# EAGLE board iv17-display-shield (EAGLE 7.3.0), part 1 of 2
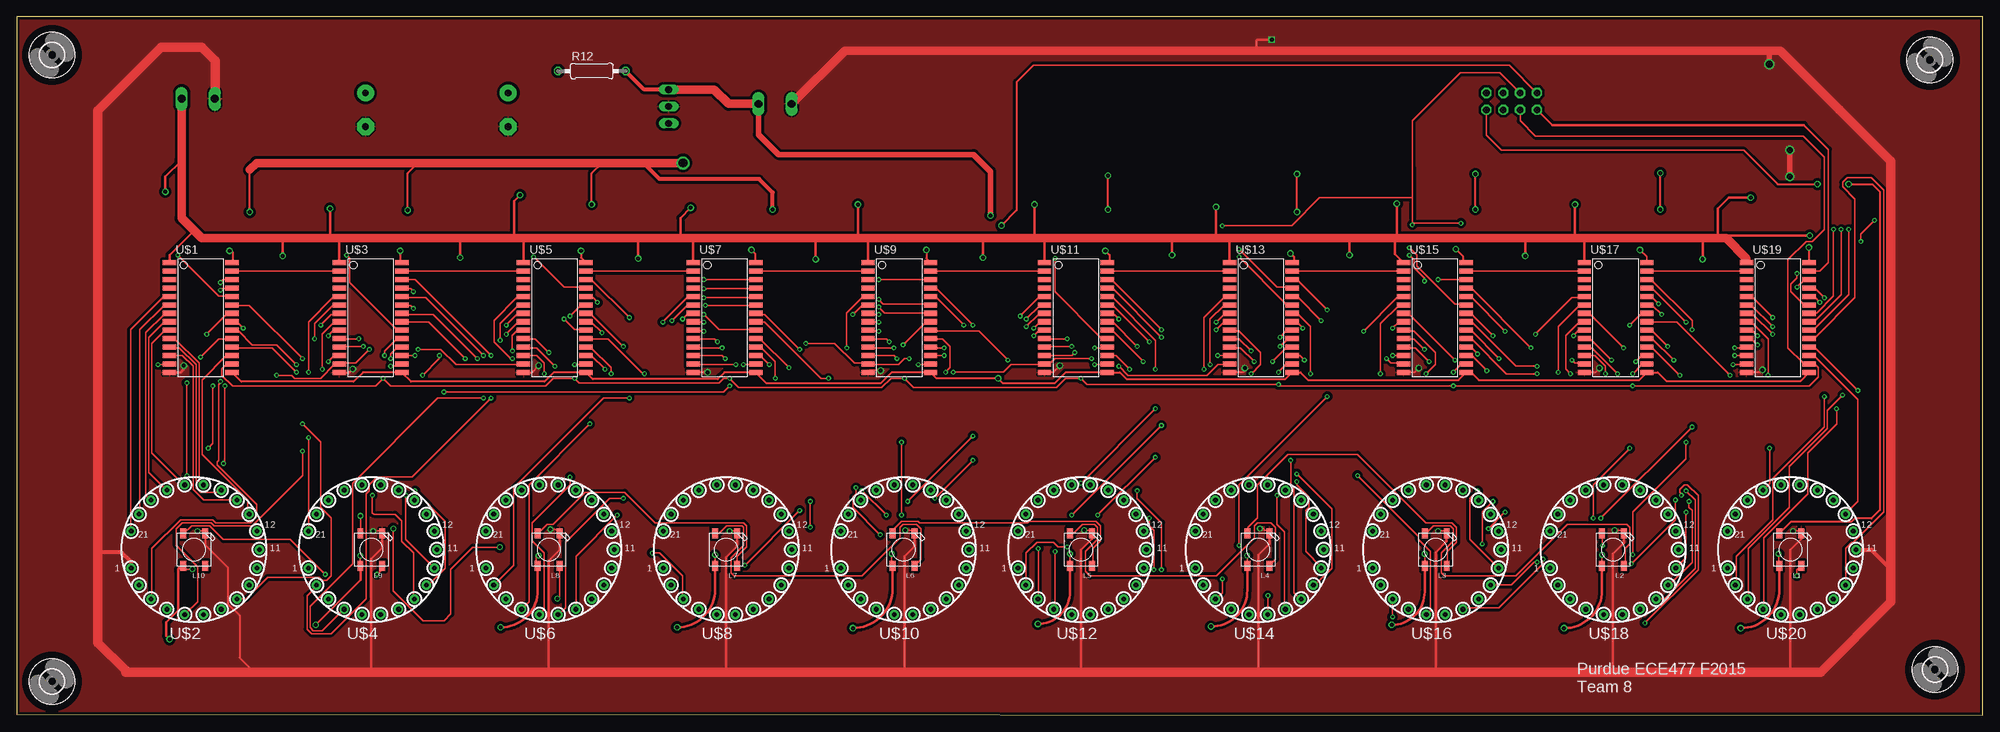
[diagram p2: board, top side]
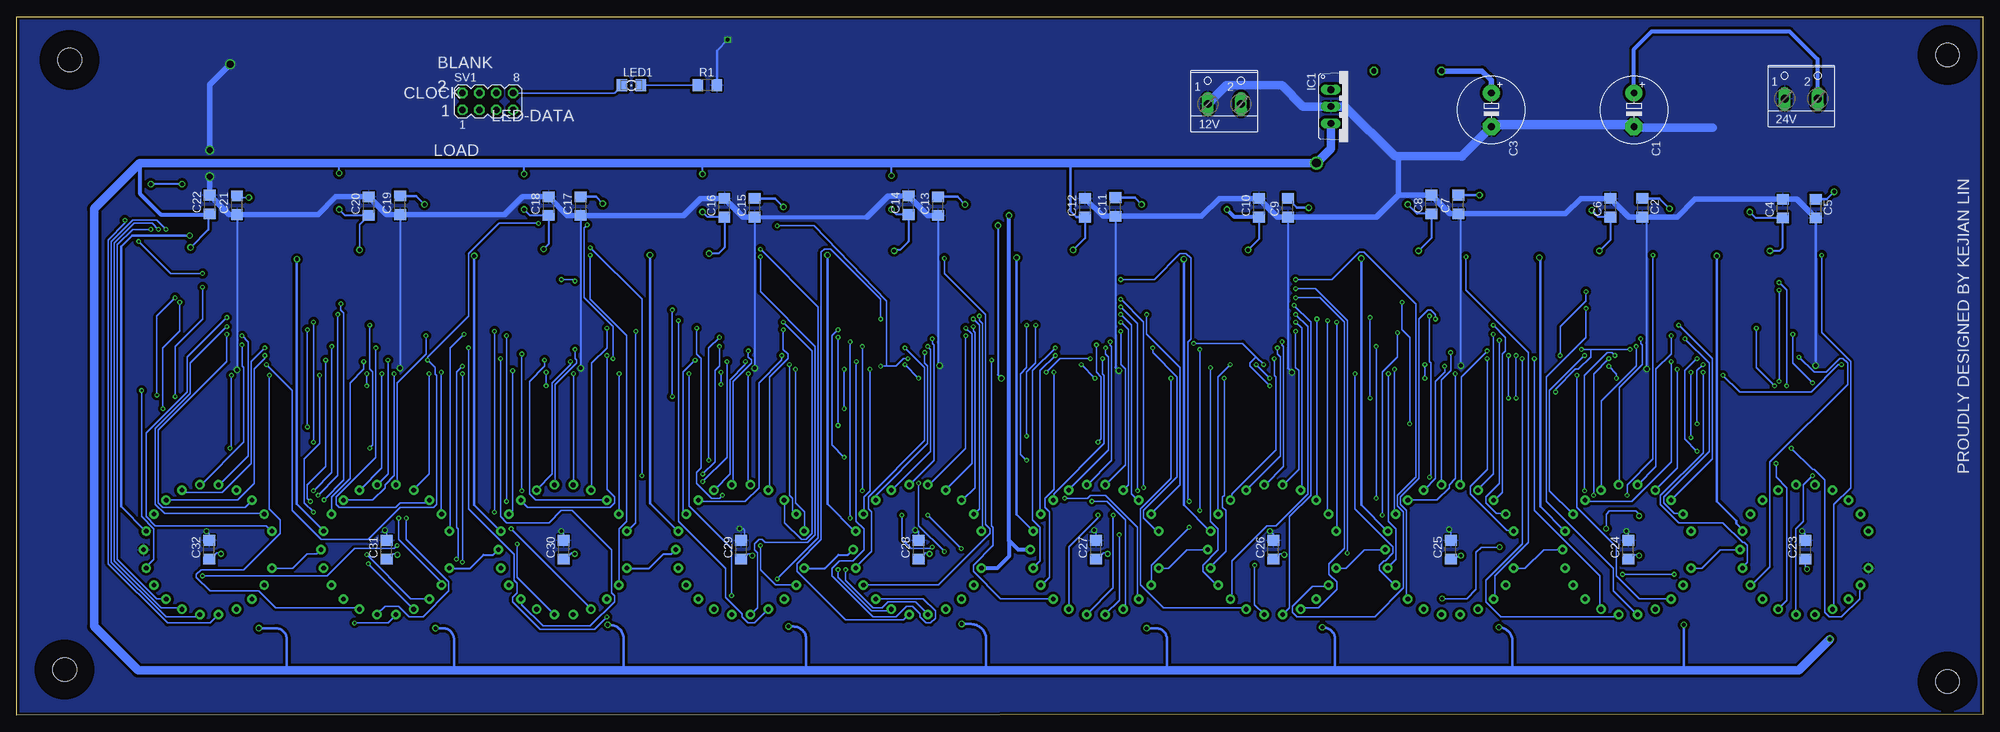
[diagram p3: board, bottom side, seen from below]

Size 295.64 x 105.08 mm. Coordinates in mm from the lower left corner, seen from the top.
Outline: 0,0.13 295.64,0 295.64,105.08 0,105.08 0,0.13
Copper layers (1*16): Top 0.0356mm / dielectric 1.5011mm / Bottom 0.0356mm
Design rules "477rec *": minimum track width 8mil, minimum drill 13mil, track to track 10mil, track to pad 10mil, pad to pad 10mil, via to via 10mil, smd to smd 6mil, copper to edge 15mil, drill to drill 8mil, minimum pad ring 7mil, minimum via ring 7mil, stop-mask expansion 3mil, vias tented up to drill 0mil, thermal gap 10mil

## Footprints (pad centres in the part's own frame; a part is rotated, then mirrored left to right if it is on the bottom)
W237-102 = drill 1.194 long: 1 -2.5,-1.27; 2 2.5,-1.27
E5-10,5 = drill 1.016 pad 2.54: + -2.54,0 | drill 1.016 pad 2.54 octagon: - 2.54,0
C1206 = smd 1.6 x 1.8: 1 -1.4,0; 2 1.4,0
TO220V = drill 1.016 long: 1 -2.54,-2.54; 2 0,-2.54; 3 2.54,-2.54
WS2812B = smd 1.5 x 0.9: 1-VDD 2.45,-1.65; 2-DOUT 2.45,1.65; 3-GND -2.45,1.65; 4-DIN -2.45,-1.65
1206 = smd 1.6 x 1.803: A -1.422,0; C 1.422,0
R1206 = smd 1.6 x 1.803: 1 -1.422,0; 2 1.422,0
0207/10 = drill 0.813 octagon: 1 -5.08,0; 2 5.08,0
MA04-2 = drill 1.016 octagon: 1 -3.81,-1.27; 2 -3.81,1.27; 3 -1.27,-1.27; 4 -1.27,1.27; 5 1.27,-1.27; 6 1.27,1.27; 7 3.81,-1.27; 8 3.81,1.27
SOIC-28W = smd 0.762 x 2: 1 -8.89,-4.7; 2 -7.62,-4.7; 3 -6.35,-4.7; 4 -5.08,-4.7; 5 -3.81,-4.7; 6 -2.54,-4.7; 7 -1.27,-4.7; 8 0,-4.7; 9 1.27,-4.7; 10 2.54,-4.7; 11 3.81,-4.7; 12 5.08,-4.7; 13 6.35,-4.7; 14 7.62,-4.7; 15 7.62,4.7; 16 6.35,4.7; 17 5.08,4.7; 18 3.81,4.7; 19 2.54,4.7; 20 1.27,4.7; 21 0,4.7; 22 -1.27,4.7; 23 -2.54,4.7; 24 -3.81,4.7; 25 -5.08,4.7; 26 -6.35,4.7; 27 -7.62,4.7; 28 -8.89,4.7
NIXIE-22 = drill 0.7 pad 1.422: 1 -9.451,-2.775; 2 -8.287,-5.325; 3 -6.45,-7.444; 4 -4.092,-8.96; 5 -1.402,-9.75; 6 1.402,-9.75; 7 4.092,-8.96; 8 6.45,-7.444; 9 8.287,-5.325; 10 9.451,-2.775; 11 9.85,0; 12 9.451,2.775; 13 8.287,5.325; 14 6.45,7.444; 15 4.092,8.96; 16 1.402,9.75; 17 -1.402,9.75; 18 -4.092,8.96; 19 -6.45,7.444; 20 -8.287,5.325; 21 -9.451,2.775
3,6 = hole 3.6: 0,0

## Placement (x,y rotation side)
12V  [W237-102]  114.05,93.22 0 bottom
24V  [W237-102]  27.3,93.98 0 bottom
C1  470uf  [E5-10,5]  52.45,91.06 270 bottom
C2  100nf  [C1206]  51.18,76.33 270 bottom
C3  470uf  [E5-10,5]  73.91,91.06 270 bottom
C4  100nf  [C1206]  30.1,76.2 90 bottom
C5  100nf  [C1206]  25.15,76.2 270 bottom
C6  100nf  [C1206]  56.01,76.33 90 bottom
C7  100nf  [C1206]  78.87,76.84 90 bottom
C8  100nf  [C1206]  82.93,76.84 90 bottom
C9  100nf  [C1206]  104.52,76.33 90 bottom
C10  100nf  [C1206]  108.84,76.33 90 bottom
C11  100nf  [C1206]  130.43,76.45 90 bottom
C12  100nf  [C1206]  135,76.33 90 bottom
C13  100nf  [C1206]  157.1,76.58 90 bottom
C14  100nf  [C1206]  161.54,76.71 90 bottom
C15  100nf  [C1206]  184.66,76.33 90 bottom
C16  100nf  [C1206]  189.23,76.33 90 bottom
C17  100nf  [C1206]  210.82,76.58 90 bottom
C18  100nf  [C1206]  215.65,76.58 90 bottom
C19  100nf  [C1206]  238,76.71 90 bottom
C20  100nf  [C1206]  242.7,76.58 90 bottom
C21  100nf  [C1206]  262.51,76.71 90 bottom
C22  100nf  [C1206]  266.57,76.84 90 bottom
C23  100nf  [C1206]  26.67,24.89 90 bottom
C24  100nf  [C1206]  53.34,24.89 90 bottom
C25  100nf  [C1206]  80.01,24.89 90 bottom
C26  100nf  [C1206]  106.68,24.89 90 bottom
C27  100nf  [C1206]  133.35,24.89 90 bottom
C28  100nf  [C1206]  160.02,24.89 90 bottom
C29  100nf  [C1206]  186.69,24.89 90 bottom
C30  100nf  [C1206]  213.36,24.89 90 bottom
C31  100nf  [C1206]  240.03,24.89 90 bottom
C32  100nf  [C1206]  266.7,24.89 90 bottom
IC1  MURATA 5V  [TO220V]  95.5,91.57 270 bottom
L1  WS2812B  [WS2812B]  266.7,24.89 270 top
L2  WS2812B  [WS2812B]  240.03,24.89 270 top
L3  WS2812B  [WS2812B]  213.36,24.89 270 top
L4  WS2812B  [WS2812B]  186.69,24.89 270 top
L5  WS2812B  [WS2812B]  160.02,24.89 270 top
L6  WS2812B  [WS2812B]  133.35,24.89 270 top
L7  WS2812B  [WS2812B]  106.68,24.89 270 top
L8  WS2812B  [WS2812B]  80.01,24.89 270 top
L9  WS2812B  [WS2812B]  53.34,24.89 270 top
L10  WS2812B  [WS2812B]  26.67,24.89 270 top
LED1  [1206]  203.2,94.74 0 bottom
R1  [R1206]  191.77,94.74 0 bottom
R12  [0207/10]  86.49,96.9 0 top
SV1  [MA04-2]  224.79,92.33 0 bottom
U$1  MAX6921  [SOIC-28W]  27.69,59.18 270 top
U$2  IV17  [NIXIE-22]  26.67,24.89 0 top
U$3  MAX6921  [SOIC-28W]  53.21,59.18 270 top
U$4  IV17  [NIXIE-22]  53.34,24.89 0 top
U$5  MAX6921  [SOIC-28W]  80.9,59.18 270 top
U$6  IV17  [NIXIE-22]  80.01,24.89 0 top
U$7  MAX6921  [SOIC-28W]  106.43,59.18 270 top
U$8  IV17  [NIXIE-22]  106.68,24.89 0 top
U$9  MAX6921  [SOIC-28W]  132.72,59.18 270 top
U$10  IV17  [NIXIE-22]  133.35,24.89 0 top
U$11  MAX6921  [SOIC-28W]  159.26,59.18 270 top
U$12  IV17  [NIXIE-22]  160.02,24.89 0 top
U$13  MAX6921  [SOIC-28W]  187.07,59.18 270 top
U$14  IV17  [NIXIE-22]  186.69,24.89 0 top
U$15  MAX6921  [SOIC-28W]  213.23,59.18 270 top
U$16  IV17  [NIXIE-22]  213.36,24.89 0 top
U$17  MAX6921  [SOIC-28W]  240.41,59.18 270 top
U$18  IV17  [NIXIE-22]  240.03,24.89 0 top
U$19  MAX6921  [SOIC-28W]  264.8,59.18 270 top
U$20  IV17  [NIXIE-22]  266.7,24.89 0 top
U$21  [3,6]  5.33,99.31 0 top
U$22  [3,6]  5.33,5.08 0 top
U$23  [3,6]  287.65,98.55 0 top
U$24  [3,6]  288.42,6.86 0 top

## Tracks (layer width: path | path; a pad name or v marks a point on that pad's centre or on a via)
5VDC  (via drill 0.5, 0.6, 1.3)
  Top 0.203: 217.4,68.05 217.86,68.05 U$15.28
  Top 0.254: U$17.28 245.11,68.96 v244.09,69.98 | v26.42,21.97 25.49,21.97 L10.1-VDD | v51.69,24 L9.1-VDD | v78.49,24 78.36,24 78.11,23.75 78.11,22.7 L8.1-VDD | v105.03,24.13 L7.1-VDD | v131.57,24.26 131.57,22.57 L6.1-VDD | v158.37,24.26 L5.1-VDD | v185.04,24 L4.1-VDD | v211.71,24.26 L3.1-VDD | v238.38,24.13 L2.1-VDD | v264.92,24.26 264.92,22.57 L1.1-VDD
  Top 0.305: v32,69.85 32.26,69.85 32.51,69.6 32.51,68.2 U$1.28 | v57.66,69.85 57.66,68.33 U$3.28 | v84.84,69.85 84.84,68.84 U$5.28 | v110.49,69.98 111,69.47 111,68.2 U$7.28 | v136.78,69.98 136.78,68.71 U$9.28 | v163.7,69.85 164.34,69.22 164.34,68.45 U$11.28 | v191.52,69.47 192.02,68.96 192.02,68.33 U$13.28 | v216.41,70.1 217.42,69.09 217.42,68.07 217.4,68.05 217.3,67.95 | v269.49,70.36 U$19.28 | v35.05,75.69 35.05,82.04 | v58.8,75.95 58.8,81.53 60.33,83.06 | v86.49,76.84 86.49,81.53 88.01,83.06 | v192.53,75.69 v192.53,81.41 | v219.33,76.07 v219.33,81.41 | v247.14,76.07 v247.14,81.53 | v164.08,76.07 v164.08,81.15
  Top 0.406: L9.1-VDD 51.69,20.32 v44.96,13.59 | L7.1-VDD 105.03,18.92 arc-90 v99.31,13.21 | L6.1-VDD 131.7,19.05 arc-90 v125.73,13.08 | L5.1-VDD 158.37,18.54 arc-90 v153.54,13.72 | L4.1-VDD 185.04,18.8 arc-90 v179.58,13.34 | L3.1-VDD 211.71,18.54 | 211.71,18.54 arc-90 v206.76,13.59 arc90 211.71,18.54 | L2.1-VDD 238.38,18.8 arc-90 v232.66,13.08 | L10.1-VDD arc90 24.26,21.68 24.26,15.75 22.48,13.97 22.48,11.94 v22.99,11.43 | L1.1-VDD 265.05,18.92 | 265.05,18.92 arc-90 v259.21,13.08 arc90 265.05,18.92 | L8.1-VDD 78.36,18.8 arc-90 v72.77,13.21
  Top 0.61: v113.67,76.07 113.67,78.61 111.63,80.65 96.65,80.65 94.23,83.06
  Top 1.27: v100.2,83.06 94.23,83.06 88.01,83.06 60.33,83.06 36.07,83.06 35.05,82.04
  Bottom 0.254: v244.09,69.98 244.09,73.78 C20.1 | C23.1 26.67,22.23 v26.42,21.97 | C24.1 52.96,23.49 52.32,24.13 51.82,24.13 v51.69,24 | C25.1 79.38,23.49 78.87,24 v78.49,24 | C26.1 106.55,23.49 106.43,23.37 106.43,23.49 105.66,24.26 105.16,24.26 v105.03,24.13 | C27.1 133.1,23.49 132.21,24.38 131.7,24.38 v131.57,24.26 | C28.1 159.89,23.37 159.89,23.49 159,24.38 158.5,24.38 v158.37,24.26 | C29.1 186.44,23.49 185.67,24.26 185.29,24.26 v185.04,24 | C30.1 213.11,23.49 212.22,24.38 211.84,24.38 v211.71,24.26 | C31.1 239.78,23.49 239.01,24.26 238.51,24.26 v238.38,24.13 | C32.1 266.45,23.49 265.56,24.38 265.05,24.38 v264.92,24.26
  Bottom 0.305: v32,69.85 30.61,69.85 30.1,70.36 C4.1 34.16,74.8 v35.05,75.69 | v57.66,69.85 56.01,71.5 C6.1 57.78,74.93 v58.8,75.95 | v84.84,69.85 82.93,71.75 C8.1 85.09,75.44 v86.49,76.84 | C10.1 108.84,71.63 v110.49,69.98 | C12.1 135,71.75 v136.78,69.98 | v163.7,69.85 163.58,69.98 162.81,69.98 161.54,71.25 C14.1 163.32,75.31 v164.08,76.07 | v191.52,69.47 190.12,69.47 189.23,70.36 C16.1 191.77,74.93 v192.53,75.69 | v216.41,70.1 215.65,70.87 C18.1 218.44,75.18 v219.33,76.07 | C22.1 266.57,75.18 266.83,74.93 266.83,73.03 v269.49,70.36 | 165.35,82.8 165.61,83.06 | v192.53,81.41 192.53,82.93 192.66,83.06 | v219.33,81.41 219.33,82.93 219.46,83.06 | C20.1 246.25,75.18 v247.14,76.07 | v247.14,81.53 247.14,83.06 | v164.08,81.15 164.08,82.55 163.58,83.06
  Bottom 0.406: v99.31,13.21 99.19,13.21 arc90 97.41,11.43 97.41,6.98 97.16,6.73 | v125.73,13.08 124.33,13.08 arc90 122.68,11.43 122.68,7.24 123.19,6.73 | v153.54,13.72 152.15,13.72 arc90 149.86,11.43 149.86,6.98 150.11,6.73 | v179.58,13.34 178.82,13.34 arc90 176.91,11.43 176.91,7.11 177.29,6.73 | 206.5,13.59 arc90 204.34,11.43 | v232.66,13.08 231.52,13.08 arc90 229.87,11.43 229.87,7.11 230.25,6.73 | 256.67,13.08 arc90 255.02,11.43 | C12.1 136.27,74.93 137.16,75.82 137.16,82.8 136.91,83.06 | v44.96,13.59 44.96,6.73 | v259.21,13.08 256.67,13.08 | 256.67,13.08 arc90 255.02,11.43 | 255.02,11.43 255.02,6.86 arc90 255.14,6.73 | v206.76,13.59 206.5,13.59 | 206.5,13.59 arc90 204.34,11.43 | 204.34,11.43 204.34,6.86 arc-90 204.22,6.73 | 70.23,6.98 arc-90 69.98,6.73 | v72.77,13.21 arc90 70.74,11.18 70.74,6.73
  Bottom 0.61: 277.11,83.06 277.11,78.49 273.94,75.31 267.21,75.31 266.83,74.93 | C10.1 112.52,74.93 v113.67,76.07
  Bottom 1.27: IC1.3 98.04,85.22 v100.2,83.06 136.91,83.06 163.58,83.06 165.61,83.06 192.66,83.06 219.46,83.06 247.14,83.06 277.11,83.06 283.97,76.2 283.97,13.34 277.37,6.73 255.14,6.73 230.25,6.73 204.22,6.73 177.29,6.73 150.11,6.73 123.19,6.73 97.16,6.73 70.74,6.73 69.98,6.73 44.96,6.73 27.69,6.73 v22.99,11.43
12VDC  (via drill 0.6)
  Top 0.61: IC1.1 94.36,94.11 R12.2
  Top 0.813: 12V.2 111.55,87.34 114.55,84.33 143.89,84.33 146.43,81.79 v146.43,75.18
  Top 1.27: 12V.2 107.06,91.95 104.9,94.11 IC1.1
  Bottom 0.61: U$10.11 145.03,24.89 146.43,26.29 | 146.43,26.29 v146.43,75.18 | 146.43,26.29 146.43,23.88 148.21,22.1 150.55,22.1 U$12.1
24VDC  (via drill 0.6)
  Top 0.406: 260.1,68.71 U$19.1 | v47.12,76.2 47.12,71.75 | U$3.1 48.51,70.11 48.51,71.75 | U$5.1 76.2,70.36 76.2,71.75 | 74.8,71.75 74.8,77.34 v75.69,78.23 | U$7.1 101.73,69.85 101.73,71.75 | v101.35,76.33 99.82,74.8 99.82,71.75 | v126.49,76.84 126.49,72.01 126.24,71.75 | v153.03,76.84 153.03,71.88 153.16,71.75 | v180.34,76.45 180.34,71.88 180.21,71.75 | v207.52,76.96 207.52,72.01 207.26,71.75 207.26,69.34 U$15.1 | U$9.1 128.01,69.98 128.02,69.98 128.02,71.75 | U$11.1 154.56,70.11 154.56,71.75 | U$13.1 182.37,69.98 182.37,71.75 | U$17.1 235.71,70.49 235.71,71.75 | v260.73,77.85 257.43,77.85 255.78,76.2 255.78,71.88 | 255.78,71.88 255.78,71.75 | v234.31,76.84 234.31,71.88 234.44,71.75 | U$1.1 22.99,69.21 26.67,72.9 | v22.35,78.74 22.35,80.99 24.8,83.44 | v120.14,68.58 120.14,71.75 | 200.41,70.74 v200.41,69.22 200.41,71.75 | v269.62,72.14 256.03,72.14 255.78,71.88 | v40.01,69.09 40.01,71.75 | v66.67,68.83 66.67,71.75 | v253.49,68.58 253.49,71.75 | v226.82,69.09 226.82,71.75 | v173.74,69.22 173.74,71.75 | v145.29,68.83 145.29,71.75 | v93.47,68.71 93.47,71.75
  Top 1.27: 24V.2 24.8,83.44 24.8,74.76 26.67,72.9 27.81,71.75 40.01,71.75 47.12,71.75 48.51,71.75 66.67,71.75 74.8,71.75 76.2,71.75 93.47,71.75 99.82,71.75 101.73,71.75 120.14,71.75 126.24,71.75 128.02,71.75 145.29,71.75 153.16,71.75 154.56,71.75 173.74,71.75 180.21,71.75 182.37,71.75 200.41,71.75 207.26,71.75 226.82,71.75 234.44,71.75 235.71,71.75 253.49,71.75 255.78,71.75 257.05,71.75 260.1,68.71
  Bottom 0.254: v260.73,77.85 262.25,77.85 C21.2
  Bottom 0.406: C2.1 48.64,77.73 v47.12,76.2 | v75.69,78.23 C7.2 | v101.35,76.33 103.12,76.33 C9.2 | C11.2 127.51,77.85 v126.49,76.84 | C13.2 154.18,77.98 v153.03,76.84 | C15.2 181.61,77.73 v180.34,76.45 | C17.2 208.54,77.98 v207.52,76.96 | C19.2 235.59,78.11 v234.31,76.84 | 25.15,77.85 C5.1 23.49,77.6 v22.35,78.74 | U$2.12 36.12,27.87 37.08,28.83 37.08,29.21 40.01,32.13 v40.01,69.09 | U$4.12 62.85,27.67 66.55,31.37 66.55,68.71 v66.67,68.83 | U$6.12 89.52,27.67 93.47,31.62 v93.47,68.71 | U$8.12 116.19,27.67 120.14,31.62 v120.14,68.58 | U$10.12 142.8,27.74 145.29,30.23 v145.29,68.83 | U$12.12 169.65,27.67 173.74,31.75 v173.74,69.22 | U$14.12 196.2,27.67 200.41,31.88 v200.41,69.22 | U$16.12 222.87,27.67 226.82,31.62 v226.82,69.09 | U$18.12 249.48,27.74 253.49,31.75 v253.49,68.58 | U$20.12 276.21,27.67 279.91,31.37 279.91,70.48 278.26,72.14 v269.62,72.14
  Bottom 0.61: C1.+ 52.45,100.2 49.78,102.87 29.08,102.87 24.89,98.68 24.89,92.8 24V.2
+12V
  Bottom 0.813: C3.+ 73.91,95.5 75.31,96.9 R12.1
AGND  (via drill 0.5, 0.6, 0.9, 1)
  Top 0.254: v267.08,27.69 268.01,27.69 L1.3-GND | v27.18,27.69 27.98,27.69 L10.3-GND | v53.59,27.69 54.65,27.69 L9.3-GND | v80.26,27.94 81.06,27.94 L8.3-GND | v107.19,27.69 107.99,27.69 L7.3-GND | v133.6,27.81 134.53,27.81 L6.3-GND | v160.53,27.81 161.2,27.81 L5.3-GND | v213.74,27.69 214.67,27.69 L3.3-GND | v240.28,27.81 241.21,27.81 L2.3-GND | v186.94,28.07 187.45,28.07 187.71,27.81 188.47,27.81 188.34,27.69 L4.3-GND
  Top 0.305: U$3.14 50.04,51.56 v50.55,52.07 | U$5.14 77.47,51.56 v78.49,52.58 | v103.89,51.56 U$7.14 | v129.92,51.82 128.27,51.82 U$9.14 | v156.84,52.58 155.83,51.56 U$11.14 | v184.66,52.2 184.66,51.82 184.4,51.56 U$13.14 | v210.82,52.2 210.19,51.56 U$15.14 | v238,52.2 237.36,51.56 U$17.14 | v262.51,51.94 262.13,51.56 U$19.14 | L10.3-GND 28.32,25.66 31.75,22.23 31.75,16.76 33.53,14.99 33.53,8.64 35.69,6.48
  Top 0.406: L9.3-GND 54.99,25.15 53.34,23.49 53.34,6.48 | L8.3-GND 81.66,24.89 80.01,23.24 80.01,6.6 79.88,6.48 | L7.3-GND 108.33,25.4 106.68,23.75 106.68,6.73 106.43,6.48 | L6.3-GND 135,25.4 133.48,23.88 133.48,6.73 133.73,6.48 | L5.3-GND 161.67,26.54 160.02,24.89 160.02,6.6 159.89,6.48 | L4.3-GND 188.34,25.78 186.69,24.13 186.69,6.6 186.56,6.48 | L3.3-GND 215.01,26.16 213.36,24.51 213.36,6.6 213.49,6.48 | L2.3-GND 241.68,25.91 240.03,24.26 240.03,6.86 239.65,6.48 | L1.3-GND 268.35,26.54 266.7,24.89 266.7,6.6 266.83,6.48 | v25.15,52.58 25.15,52.07 24.64,51.56 U$1.14 | U$2.1 17.22,22.66 | v188.72,101.6 186.56,101.6 186.44,101.47 186.44,100.08 186.56,99.95
  Top 0.61: U$20.11 278.89,24.89 281.81,21.97 | 17.22,22.66 17.22,23.04 15.75,24.51 12.19,24.51
  Top 0.813: v266.57,81.03 v266.57,84.96 | v263.52,97.92 263.52,99.95
  Top 1.27: 274.07,91.06 265.18,99.95 263.52,99.95 186.56,99.95 124.55,99.95 12V.1
  Top 1.422: 274.07,91.06 281.81,83.31 281.81,21.97 281.81,17.02 271.27,6.48 266.83,6.48 239.65,6.48 213.49,6.48 186.56,6.48 159.89,6.48 133.73,6.48 106.43,6.48 79.88,6.48 53.34,6.48 35.69,6.48 16.38,6.48 16.38,6.73 12.19,10.92 12.19,24.51 12.19,90.93 21.72,100.46 27.81,100.46 29.84,98.43 29.84,92.71 29.97,92.58
  Bottom 0.254: C32.2 266.7,27.3 v267.08,27.69 | C23.2 26.67,27.18 v27.18,27.69 | C24.2 53.34,27.43 v53.59,27.69 | C25.2 80.01,27.69 v80.26,27.94 | C26.2 106.68,27.18 v107.19,27.69 | C27.2 133.35,27.56 v133.6,27.81 | C28.2 160.02,27.69 160.15,27.81 v160.53,27.81 | C30.2 213.36,27.3 v213.74,27.69 | C31.2 240.03,27.56 v240.28,27.81 | C29.2 186.18,26.8 186.18,27.81 186.44,28.07 v186.94,28.07
  Bottom 0.305: v50.55,52.07 50.55,74.29 C2.2 | v78.49,52.58 78.49,75.05 C7.1 | C9.1 104.52,52.2 v103.89,51.56 | C11.1 130.43,52.32 v129.92,51.82 | C13.1 157.1,52.83 v156.84,52.58 | C15.1 v184.66,52.2 | C17.1 v210.82,52.2 | C19.1 v238,52.2 | C21.1 v262.51,51.94
  Bottom 0.406: C13.1 158.62,75.18 C14.2 | C20.2 | C18.2 | C16.2 | C2.2 | C6.2 | C8.2 | C10.2 | 87.88,83.82 88.14,84.07 | C5.2 v25.15,52.58 | R1.2 190.35,99.97 v188.72,101.6
  Bottom 0.61: C15.1 167.77,74.93
  Bottom 0.813: C5.2 27.95,77.6 C4.2 43.3,77.6 45.97,74.93 C2.2 | C2.2 53.21,74.93 C6.2 | C8.2 80.13,75.44 C7.1 62.74,75.44 60.45,77.72 C6.2 | C10.2 106.04,74.93 C9.1 91.19,74.93 87.88,78.23 | C12.2 132.33,75.05 C11.1 117.48,75.05 114.81,77.72 C10.2 | C15.1 186.43,74.93 C16.2 | C18.2 212.85,75.18 C17.1 195.33,75.18 192.79,77.72 C16.2 | C20.2 240.02,75.31 C19.1 222.25,75.31 219.58,77.98 C18.2 | C20.2 247.65,77.98 250.32,75.31 C21.1 263.65,75.31 C22.2 v266.57,81.03 | 167.77,74.93 164.59,78.11 C14.2 | 87.88,78.23 C8.2 | 87.88,78.23 87.88,83.82 | C13.1 158.62,75.18 C14.2 | v266.57,84.96 266.57,94.87 v263.52,97.92
  Bottom 1.27: 40.64,88.39 52.03,88.39 C1.- | 12V.1 113.75,94.74 105.41,94.74 102.23,91.57 IC1.2 95.89,91.57 88.39,84.07 88.14,84.07 78.4,84.07
  Bottom 1.422: 78.4,84.07 78.36,84.07 C3.- | 73.66,88.81 52.75,88.81 C1.-
  pour Top (isolate 0.406): 0,8.38 0,105.16 295.66,105.16 295.66,81.15 295.66,0.13 295.66,0 0,0
  pour Bottom (isolate 0.406): 0,8.38 0,105.03 295.66,105.03 295.66,98.3 295.66,0 0,0
BLANK  (via drill 0.33)
  Top 0.203: v205.97,53.64 206.65,52.96 208.48,52.96 U$15.13 | 209.85,82.45 209.85,77.88 | 209.85,77.88 209.85,73.99 | v233.86,53.42 234.31,52.96 235.69,52.96 U$17.13 | 209.85,73.99 v217.17,73.99 | 209.85,73.99 v209.85,73.76 | v258.09,52.73 259.92,52.73 U$19.13 | v21.26,52.73 22.86,52.73 U$1.13 | v39.09,51.13 41.38,51.13 41.83,50.67 45.72,50.67 47.78,52.73 48.46,52.73 U$3.13 48.69,52.96 50.98,52.96 v53.03,55.02 | v60.35,55.02 63.78,55.02 66.06,52.73 76.12,52.73 U$5.13 | v108.13,52.73 101.73,52.73 U$7.13 | v118.64,55.93 122.99,55.93 125.96,52.96 127.79,52.96 U$9.13 128.02,52.73 132.59,52.73 133.5,53.64 v134.19,53.64 | v140.82,51.59 148.36,51.59 149.5,52.73 154.53,52.73 U$11.13 154.76,52.96 155.45,52.96 156.13,53.64 v161.62,53.64 | v165.74,52.5 167.11,51.13 178.99,51.13 180.59,52.73 182.19,52.73 U$13.13 | v64.24,48.62 106.3,48.62 v107.21,49.53 | 209.85,77.88 195.91,77.88 191.77,73.61 v181.28,73.61
  Top 0.254: 209.85,82.45 209.85,89.46 217.04,96.65 223.01,96.65 SV1.4
  Bottom 0.203: v205.97,53.64 205.97,58.45 210.31,62.79 210.31,73.3 v209.85,73.76 | v217.17,73.99 223.11,73.99 227.69,69.42 227.69,60.05 233.86,53.87 v233.86,53.42 232.72,52.27 232.72,51.36 232.49,51.13 232.49,31.7 232.94,31.24 237.97,31.24 242.77,26.44 249.86,26.44 254.2,30.78 254.2,48.84 v258.09,52.73 | v21.26,52.73 21.72,52.73 25.83,48.62 36.58,48.62 v39.09,51.13 | v53.03,55.02 58.98,55.02 | 58.98,55.02 v60.35,55.02 | 109.27,53.87 111.33,55.93 v118.64,55.93 | 109.27,53.87 v108.13,52.73 | v140.82,51.59 138.76,53.64 v134.19,53.64 | 164.82,52.5 163.45,52.5 162.31,53.64 v161.62,53.64 | 164.82,52.5 v165.74,52.5 | 58.98,55.02 58.98,53.87 60.81,52.04 61.27,52.04 64.24,49.07 v64.24,48.62 | v107.21,49.53 110.19,52.5 110.19,52.96 109.27,53.87 | v181.28,73.61 175.72,73.61 164.82,62.33 164.82,52.5
CLK  (via drill 0.6)
  Top 0.254: 150.37,95.25 152.91,97.79 224.41,97.79 SV1.2
  Top 0.305: 150.37,95.25 150.37,75.95 v148.08,73.66 | U$1.15 33.78,50.16 50.67,50.16 52.07,51.56 U$3.15 59.31,50.16 79.38,50.16 80.77,51.56 U$5.15 86.61,50.55 105.41,50.55 106.43,51.56 U$7.15 112.78,49.91 129.92,49.91 131.57,51.56 U$9.15 138.3,50.67 v147.57,50.67 148.34,49.91 156.08,49.91 157.73,51.56 U$11.15 165.86,51.56 166.88,50.55 190.75,50.55 U$13.15 193.04,51.56 194.18,50.42 216.79,50.42 U$15.15 218.69,51.56 219.84,50.42 243.97,50.42 U$17.15 246.76,51.56 248.03,50.29 268.23,50.29 U$19.15
  Bottom 0.305: v148.08,73.66 148.08,51.18 v147.57,50.67
DATA
  Top 0.254: U$19.27 271.14,66.8 272.42,68.07 272.42,85.09 268.73,88.77
  Top 0.406: 268.73,88.77 230.89,88.77 SV1.1
LED-DATA  (via drill 0.6)
  Top 0.254: 260.99,83.69 259.71,84.96 223.27,84.96 220.98,87.25 SV1.7
  Top 0.305: 260.99,83.69 264.8,79.88 v270.76,79.88 | v275.46,79.88 279.02,79.88 280.16,78.74 280.16,30.86 278.89,29.59 276.35,29.59 275.84,29.08 266.79,29.08 L1.4-DIN
  Bottom 0.305: v270.76,79.88 v275.46,79.88
LOAD  (via drill 0.33)
  Top 0.203: v56.24,52.5 57.61,52.5 57.84,52.73 U$3.16 | U$1.16 32.23,52.73 31.55,52.73 30.86,52.04 30.86,51.13 32.46,49.53 53.95,49.53 v55.09,50.67 56.24,49.53 79.55,49.53 80.7,50.67 v83.9,50.67 84.58,49.99 105.61,49.99 106.3,50.67 v107.21,50.67 108.58,49.3 130.07,49.3 131.44,50.67 v133.5,50.67 134.87,49.3 156.36,49.3 157.73,50.67 v160.02,50.67 160.93,49.76 v189.74,49.76 189.97,49.53 v216.03,49.53 v243,49.53 269.52,49.53 270.89,50.9 270.89,52.27 270.43,52.73 269.52,52.73 U$19.16 269.29,52.96 268.61,52.96 266.32,55.24 266.32,68.5 269.06,71.25 269.98,71.25 271.81,73.08 271.81,81.99 | v83.9,52.73 85.5,52.73 U$5.16 | v109.27,52.73 111.1,52.73 U$7.16 | v135.56,52.73 137.39,52.73 U$9.16 | v162.08,52.73 163.91,52.73 U$11.16 | v189.74,51.59 190.88,52.73 191.57,52.73 U$13.16 | v216.03,51.59 217.17,52.73 217.86,52.73 U$15.16 | v243,51.36 244.37,52.73 245.06,52.73 U$17.16
  Top 0.254: SV1.3 226.06,89.41 228.35,87.12 268.61,87.12 271.78,83.95 271.78,82.02 271.81,81.99
  Bottom 0.203: v55.09,50.67 55.09,51.36 v56.24,52.5 | v83.9,50.67 v83.9,52.73 | v107.21,50.67 v109.27,52.73 | v133.5,50.67 v135.56,52.73 | v160.02,50.67 v162.08,52.73 | v189.74,49.76 v189.74,51.59 | v216.03,49.53 v216.03,51.59 | v243,49.53 v243,51.36
N$1  (via drill 0.33)
  Top 0.203: U$1.26 31.09,65.53 v30.63,65.08 | v29.49,49.53 29.49,40.84 v28.8,40.16
  Bottom 0.203: v30.63,65.08 29.49,63.93 v29.49,49.53 | v28.8,40.16 25.6,36.96 25.38,36.96 23.77,35.36 23.77,15.47 23.09,14.78 21.26,14.78 18.52,17.53 18.52,19.36 U$2.2
N$2  (via drill 0.33)
  Top 0.203: v30.63,63.93 30.86,64.16 32.23,64.16 U$1.25 | v30.63,50.22 30.63,49.99 30.4,49.76 30.4,38.33 30.18,38.1 30.18,37.64 36.12,31.7 36.12,29.87 35.2,28.96 29.95,28.96 29.49,29.41 24.69,29.41 20.34,25.07 20.34,17.53 U$2.3
  Bottom 0.203: v30.63,50.22 v30.63,63.93
N$3  (via drill 0.33)
  Top 0.203: v24.23,69.19 30.4,63.02 32.23,63.02 U$1.24
  Bottom 0.203: v24.23,69.19 24.23,57.53 19.89,53.19 19.89,34.21 22.4,31.7 22.4,16.15 U$2.4
N$4  (via drill 0.33)
  Top 0.203: v42.98,53.64 34.98,61.65 32.46,61.65 U$1.23 | v42.98,39.7 42.98,36.04 35.43,28.5 29.72,28.5 29.26,28.96 24.92,28.96 24,28.04 24,25.53 27.2,22.33 27.2,17.07 25.38,15.24 U$2.5
  Bottom 0.203: v42.98,53.64 44.81,51.82 44.81,41.53 v42.98,39.7
N$5  (via drill 0.33)
  Top 0.203: v28.57,57.3 31.55,60.27 32.23,60.27 U$1.22 | v25.6,36.04 v25.6,49.99
  Bottom 0.203: v28.57,57.3 28.57,52.96 v25.6,49.99 | v25.6,36.04 26.98,34.67 26.98,29.19 28.12,28.04 28.12,15.24 U$2.6
N$6  (via drill 0.33)
  Top 0.203: v34.06,58.22 33.15,59.13 32.46,59.13 U$1.21 | v31.32,49.53 31.32,38.1 v31.09,37.87
  Bottom 0.203: v34.06,58.22 34.06,52.27 v31.32,49.53 | v31.09,37.87 31.09,35.81 29.49,34.21 29.49,17.3 30.63,16.15 U$2.7
N$7  (via drill 0.33)
  Top 0.203: v42.06,52.73 39.09,55.7 35.43,55.7 33.38,57.76 32.46,57.76 U$1.20 | v42.98,43.81 45.72,41.07 45.72,31.24 47.32,29.64 47.32,20.95 46.63,20.27 45.95,20.27 45.49,20.73 37.72,20.73 34.52,17.53 33.15,17.53 U$2.8
  Bottom 0.203: v42.06,52.73 42.98,51.82 v42.98,43.81
N$8  (via drill 0.33)
  Top 0.203: v27.66,53.87 30.4,56.62 32.23,56.62 U$1.19
  Bottom 0.203: v27.66,53.87 25.38,51.59 23.55,51.59 21.49,53.64 21.03,53.64 20.34,52.96 20.34,49.76 32,38.1 32,22.33 34.75,19.58 U$2.9
N$9  (via drill 0.33)
  Top 0.203: v42.06,51.59 38.41,55.24 32.46,55.24 U$1.18
  Bottom 0.203: v42.06,51.59 42.06,39.47 48.46,33.07 48.46,31.7 45.72,28.96 39.09,28.96 36.12,25.98 35.89,25.98 35.43,25.53 35.43,23.01 36.12,22.33 U$2.10
N$10
  Top 0.203: U$1.17 31.55,54.1 27.89,50.44 27.89,39.24 34.75,32.38 34.75,30.33 U$2.13
N$11
  Top 0.203: U$1.12 24.92,54.1 26.52,52.5 26.52,33.98 28.12,32.38 32.92,32.38 U$2.14
N$12
  Top 0.203: U$1.11 23.09,55.24 24.46,55.24 26.98,52.73 26.98,34.21 27.66,33.53 30.4,33.53 30.63,33.76 U$2.15
N$13
  Top 0.203: U$1.10 23.09,56.62 23.77,56.62 27.43,52.96 27.43,35.13 27.89,34.67 U$2.16
N$14
  Top 0.203: U$1.9 22.86,57.76 22.17,57.76 20.34,55.93 20.34,39.47 25.15,34.67 U$2.17
N$15
  Top 0.203: U$1.8 22.86,59.13 22.17,59.13 19.89,56.84 19.89,36.5 22.4,33.98 U$2.18
N$16
  Top 0.203: U$1.7 22.86,60.27 22.17,60.27 19.43,57.53 19.43,33.07 20.12,32.38 U$2.19
N$17
  Top 0.203: U$1.6 22.86,61.65 22.17,61.65 18.52,57.99 18.52,30.33 U$2.20
N$18
  Top 0.203: U$1.5 22.86,62.79 21.95,62.79 17.14,57.99 17.14,27.81 U$2.21
N$19  (via drill 0.33)
  Top 0.203: U$3.26 59.89,65.53 v71.32,54.1 | v71.32,47.7 59.44,35.81 54.18,35.81 53.03,34.67 53.03,33.76 52.58,33.3 52.58,17.53 47.32,12.27 44.35,12.27 43.66,12.95 43.66,17.98 45.03,19.36 U$4.2
  Bottom 0.203: v71.32,47.7 v71.32,54.1
N$20  (via drill 0.33)
  Top 0.203: v59.66,63.7 59.21,64.16 58.06,64.16 U$3.25 | v63.55,54.1 63.55,53.64 v61.04,51.13
  Bottom 0.203: v59.66,63.7 59.66,62.33 63.55,58.45 v63.55,54.1 | v61.04,51.13 61.04,31.24 55.09,25.3 55.09,20.95 51.66,17.53 47.09,17.53 U$4.3
N$21  (via drill 0.33)
  Top 0.203: v70.18,54.1 61.49,62.79 58.06,62.79 U$3.24 | v70.18,47.7 63.32,47.7 50.52,34.9 50.52,22.78 44.12,16.38 44.12,13.18 44.58,12.72 45.95,12.72 49.15,15.93 U$4.4
  Bottom 0.203: v70.18,47.7 v70.18,54.1
N$22  (via drill 0.33)
  Top 0.203: v59.66,61.19 59.21,61.65 58.06,61.65 U$3.23
  Bottom 0.203: v59.66,61.19 59.66,56.84 65.61,50.9 65.61,32.16 55.55,22.1 55.55,18.67 52.12,15.24 U$4.5
N$23
  Top 0.254: U$17.27 U$19.2
N$24  (via drill 0.33)
  Top 0.203: v69.27,53.64 62.64,60.27 58.06,60.27 U$3.22
  Bottom 0.203: v69.27,53.64 69.27,25.76 74.75,20.27 74.75,17.07 72.47,14.78 55.09,14.78 54.86,15.01 U$4.6
N$25  (via drill 0.33)
  Top 0.203: v67.44,53.64 61.95,59.13 58.06,59.13 U$3.21
  Bottom 0.203: v67.44,53.64 67.44,30.78 57.61,20.95 57.61,16.15 U$4.7
N$26  (via drill 0.33)
  Top 0.203: v49.61,69.19 50.06,68.73 50.06,65.08 57.15,57.99 57.84,57.99 U$3.20 | 53.49,30.56 v53.49,33.07 | 59.66,24.38 59.66,17.53 U$4.8
  Top 0.254: 53.49,30.56 53.49,30.45 53.72,30.23 56.9,30.23 57.91,29.21 57.91,26.14 59.66,24.38
  Bottom 0.203: v49.61,69.19 49.61,38.56 53.49,34.67 v53.49,33.07
N$27  (via drill 0.33)
  Top 0.203: v55.32,54.1 55.32,54.79 57.15,56.62 57.84,56.62 U$3.19 | v59.89,33.76 64.47,29.19 64.47,22.1 61.72,19.36 U$4.9
  Bottom 0.203: v55.32,54.1 55.78,54.56 56.46,54.56 59.89,51.13 v59.89,33.76
N$28  (via drill 0.33)
  Top 0.203: v56.24,53.64 56.24,54.33 57.15,55.24 57.84,55.24 U$3.18 | v58.52,33.07 58.52,26.44 62.64,22.33 U$4.10
  Bottom 0.203: v56.24,53.64 58.52,51.36 v58.52,33.07
N$29  (via drill 0.33)
  Top 0.203: v59.89,54.1 U$3.17
  Bottom 0.203: v59.89,54.1 65.15,48.84 65.15,33.76 61.72,30.33 U$4.13
N$30  (via drill 0.33)
  Top 0.203: U$3.12 47.78,54.1 v46.86,53.19
  Bottom 0.203: v46.86,53.19 46.86,38.1 52.81,32.16 59.66,32.16 U$4.14
N$31  (via drill 0.33)
  Top 0.203: v52.12,55.47 48.69,55.47 U$3.11
  Bottom 0.203: v52.12,55.47 52.12,52.5 57.38,47.24 57.38,33.98 U$4.15
N$32  (via drill 0.33)
  Top 0.203: v51.44,56.62 48.69,56.62 U$3.10
  Bottom 0.203: v51.44,56.62 51.44,55.93 51.21,55.7 51.21,52.73 54.63,49.3 54.63,34.67 U$4.16
N$33  (via drill 0.33)
  Top 0.203: v46.86,57.07 47.55,57.76 48.46,57.76 U$3.9
  Bottom 0.203: v46.86,57.07 46.86,54.33 49.15,52.04 49.15,37.41 51.89,34.67 U$4.17
N$34  (via drill 0.33)
  Top 0.203: v45.95,52.04 45.95,57.3 47.78,59.13 48.46,59.13 U$3.8
  Bottom 0.203: v45.95,52.04 45.95,37.19 49.15,33.98 U$4.18
N$35  (via drill 0.33)
  Top 0.203: v45.72,58.67 47.32,60.27 48.46,60.27 U$3.7
  Bottom 0.203: v45.72,58.67 40.69,53.64 40.69,38.56 46.86,32.38 U$4.19
N$36  (via drill 0.33)
  Top 0.203: v44.81,56.62 44.81,58.9 47.55,61.65 48.46,61.65 U$3.6
  Bottom 0.203: v44.81,56.62 41.15,52.96 41.15,39.7 48.01,32.84 48.01,31.93 46.41,30.33 45.26,30.33 U$4.20
N$37  (via drill 0.33)
  Top 0.203: v43.89,51.59 43.89,59.13 47.55,62.79 48.46,62.79 U$3.5 | v43.89,41.76 43.89,27.81 U$4.21
  Bottom 0.203: v43.89,41.76 v43.89,51.59
N$38  (via drill 0.33)
  Top 0.203: U$5.26 86.41,65.53 v92.13,59.82 | v92.13,47.7 88.24,47.7 74.75,34.21 74.75,22.55 71.78,19.58 U$6.2
  Bottom 0.203: v92.13,47.7 v92.13,59.82
N$39  (via drill 0.33)
  Top 0.203: v77.72,68.96 82.3,64.39 85.5,64.39 U$5.25
  Bottom 0.203: v77.72,68.96 77.72,63.93 68.35,54.56 68.35,25.98 73.38,20.95 73.38,17.53 U$6.3
N$40  (via drill 0.33)
  Top 0.203: v87.33,62.1 86.64,62.79 85.72,62.79 U$5.24 | v86.18,43.81 77.04,34.67 77.04,17.07 76.12,16.15 U$6.4
  Bottom 0.203: v87.33,62.1 87.33,57.99 86.18,56.84 v86.18,43.81
N$41
  Top 0.254: U$15.27 U$17.2
N$42  (via drill 0.33)
  Top 0.203: v83.21,60.05 84.81,61.65 85.5,61.65 U$5.23 | v83.21,35.81 83.21,34.67 77.5,28.96 77.5,26.21 79.32,24.38 79.32,15.93 78.64,15.24 U$6.5
  Bottom 0.203: v83.21,60.05 83.21,53.19 82.98,52.96 82.98,36.04 v83.21,35.81
N$43  (via drill 0.33)
  Top 0.203: v91.21,55.47 86.41,60.27 85.72,60.27 U$5.22 | v91.21,32.61 89.15,32.61 82.53,25.98 82.53,16.15 81.61,15.24 U$6.6
  Bottom 0.203: v91.21,32.61 v91.21,55.47
N$44  (via drill 0.33)
  Top 0.203: v88.01,57.53 86.41,59.13 85.72,59.13 U$5.21 | v90.3,30.1 84.12,23.93 84.12,16.15 U$6.7
  Bottom 0.203: v88.01,57.53 88.01,53.87 90.3,51.59 v90.3,30.1
N$45  (via drill 0.33)
  Top 0.203: v82.3,59.59 83.9,57.99 85.5,57.99 U$5.20
  Bottom 0.203: v82.3,59.59 82.3,60.27 82.98,60.96 83.44,60.96 84.81,59.59 84.81,35.59 87.55,32.84 87.55,31.7 86.64,30.78 86.64,17.53 U$6.8
N$46  (via drill 0.33)
  Top 0.203: v94.41,51.36 94.18,51.36 88.92,56.62 85.72,56.62 U$5.19
  Bottom 0.203: v94.41,51.36 94.41,31.01 88.7,25.3 88.7,24.38 89.84,23.24 90.07,23.24 90.75,22.55 90.75,21.87 88.47,19.58 U$6.9
N$47  (via drill 0.33)
  Top 0.203: v89.38,51.36 89.38,52.27 86.41,55.24 85.72,55.24 U$5.18
  Bottom 0.203: v89.38,51.36 89.38,29.19 88.24,28.04 88.24,23.47 89.38,22.33 U$6.10
N$48  (via drill 0.33)
  Top 0.203: U$5.17 86.41,54.1 v88.47,52.04
  Bottom 0.203: v88.47,52.04 88.47,30.33 U$6.13
N$49  (via drill 0.33)
  Top 0.203: U$5.12 78.18,54.1 79.32,52.96 v79.32,51.36
  Bottom 0.203: v79.32,51.36 79.32,35.59 80.24,34.67 80.24,34.21 82.07,32.38 86.41,32.38 U$6.14
N$50  (via drill 0.33)
  Top 0.203: v80.92,52.5 78.18,55.24 76.35,55.24 U$5.11
  Bottom 0.203: v80.92,52.5 80.92,51.59 82.3,50.22 82.3,35.59 83.9,33.98 U$6.15
N$51  (via drill 0.33)
  Top 0.203: v80.01,54.56 77.95,56.62 76.35,56.62 U$5.10
  Bottom 0.203: v80.01,54.56 80.01,51.82 81.38,50.44 81.38,34.67 U$6.16
N$52  (via drill 0.33)
  Top 0.203: v74.52,54.79 74.52,57.07 75.21,57.76 76.12,57.76 U$5.9
  Bottom 0.203: v74.52,54.79 78.41,50.9 78.41,34.67 U$6.17
N$53  (via drill 0.33)
  Top 0.203: v73.61,57.3 75.44,59.13 76.12,59.13 U$5.8
  Bottom 0.203: v73.61,57.3 73.61,36.27 75.89,33.98 U$6.18
N$54  (via drill 0.33)
  Top 0.203: v73.61,58.67 75.21,60.27 76.12,60.27 U$5.7
  Bottom 0.203: v73.61,58.67 71.78,56.84 71.78,54.79 72.24,54.33 72.24,33.53 73.38,32.38 U$6.19
N$55  (via drill 0.33)
  Top 0.203: v72.69,56.39 72.69,58.9 75.44,61.65 76.12,61.65 U$5.6
  Bottom 0.203: v72.69,56.39 72.69,34.9 74.75,32.84 74.75,31.93 73.15,30.33 71.78,30.33 U$6.20
N$56  (via drill 0.33)
  Top 0.203: v74.52,53.64 74.3,53.64 71.78,56.16 71.78,59.36 75.21,62.79 76.12,62.79 U$5.5
  Bottom 0.203: v74.52,53.64 74.52,36.96 77.04,34.44 77.04,33.3 71.55,27.81 70.64,27.81 U$6.21
N$57  (via drill 0.33)
  Top 0.203: v103.33,65.53 U$7.26
  Bottom 0.203: v103.33,65.53 97.84,65.53 93.73,69.65 93.04,69.65 85.27,61.87 85.27,35.81 88.01,33.07 88.01,31.47 87.1,30.56 87.1,19.13 91.44,14.78 103.1,14.78 103.78,15.47 103.78,16.38 100.81,19.36 98.53,19.36 U$8.2
N$58  (via drill 0.33)
  Top 0.203: v103.33,64.16 111.1,64.16 U$7.25 | v95.56,24.38 96.7,24.38 100.13,20.95 100.13,17.53 U$8.3
  Bottom 0.203: v103.33,64.16 100.36,64.16 95.56,59.36 v95.56,24.38
N$59  (via drill 0.33)
  Top 0.203: v103.33,62.79 111.1,62.79 U$7.24
  Bottom 0.203: v103.33,62.79 99.67,62.79 96.01,59.13 96.01,25.07 98.3,22.78 98.3,21.18 97.16,20.04 97.16,18.9 99.9,16.15 102.41,16.15 U$8.4
N$60  (via drill 0.33)
  Top 0.203: v103.56,61.65 111.1,61.65 U$7.23
  Bottom 0.203: v103.56,61.65 101.04,59.13 101.04,33.07 104.24,29.87 104.24,16.15 105.16,15.24 U$8.5
N$61  (via drill 0.33)
  Top 0.203: v117.73,55.02 112.47,60.27 111.33,60.27 U$7.22 | v109.5,22.55 v117.73,30.78
  Bottom 0.203: v117.73,30.78 v117.73,55.02 | v109.5,22.55 109.5,16.61 108.13,15.24 U$8.6
N$62  (via drill 0.33)
  Top 0.203: v122.07,50.67 120.93,50.67 112.47,59.13 111.33,59.13 U$7.21
  Bottom 0.203: v122.07,50.67 122.07,35.59 126.64,31.01 126.64,19.58 123.22,16.15 110.87,16.15 U$8.7
N$63
  Top 0.254: U$11.27 U$13.2
N$64  (via drill 0.33)
  Top 0.203: v103.33,60.27 105.61,57.99 111.1,57.99 U$7.20
  Bottom 0.203: v103.33,60.27 101.5,58.45 101.5,33.3 106.3,28.5 107.67,28.5 112.93,23.24 112.93,17.53 U$8.8
N$65  (via drill 0.33)
  Top 0.203: v116.13,52.27 111.78,56.62 111.33,56.62 U$7.19
  Bottom 0.203: v116.13,52.27 116.13,29.19 114.99,28.04 114.99,24.84 117.27,22.55 117.27,21.64 114.99,19.36 U$8.9
N$66  (via drill 0.33)
  Top 0.203: v114.07,50.67 114.07,53.19 112.01,55.24 111.33,55.24 U$7.18
  Bottom 0.203: v114.07,50.67 114.07,33.07 114.3,32.84 114.3,31.24 113.84,30.78 113.84,24.61 116.13,22.33 U$8.10
N$67  (via drill 0.33)
  Top 0.203: U$7.17 111.78,54.1 v113.16,52.73
  Bottom 0.203: v113.16,52.73 114.99,50.9 114.99,30.33 U$8.13
N$68  (via drill 0.33)
  Top 0.203: U$7.12 106.07,54.1 v106.53,53.64
  Bottom 0.203: v106.53,53.64 106.53,51.13 106.3,50.9 106.3,39.93 112.93,33.3 112.93,32.38 U$8.14
N$69  (via drill 0.33)
  Top 0.203: v106.07,55.24 101.73,55.24 U$7.11
  Bottom 0.203: v106.07,55.24 106.07,54.33 105.61,53.87 105.61,39.01 110.64,33.98 U$8.15
N$70  (via drill 0.33)
  Top 0.203: v105.39,56.16 104.93,56.62 101.73,56.62 U$7.10
  Bottom 0.203: v105.39,56.16 105.39,55.7 105.16,55.47 105.16,37.41 107.9,34.67 U$8.16
N$71  (via drill 0.33)
  Top 0.203: v103.33,57.76 101.73,57.76 U$7.9
  Bottom 0.203: v103.33,57.76 103.33,52.27 102.87,51.82 102.87,36.96 105.16,34.67 U$8.17
N$72  (via drill 0.33)
  Top 0.203: v103.33,59.13 101.73,59.13 U$7.8
  Bottom 0.203: v103.33,59.13 102.41,58.22 102.41,33.98 U$8.18
N$73  (via drill 0.33)
  Top 0.203: v100.13,59.59 100.81,60.27 101.5,60.27 U$7.7
  Bottom 0.203: v100.13,59.59 100.13,32.38 U$8.19
N$74  (via drill 0.33)
  Top 0.203: v98.53,59.36 100.81,61.65 101.5,61.65 U$7.6
  Bottom 0.203: v98.53,59.36 98.53,30.33 U$8.20
N$75  (via drill 0.33)
  Top 0.203: v97.16,59.13 100.81,62.79 101.5,62.79 U$7.5
  Bottom 0.203: v97.16,59.13 97.16,27.81 U$8.21
N$76  (via drill 0.33)
  Top 0.203: v129.62,65.53 U$9.26 | v119.33,28.27 v119.33,32.16
  Bottom 0.203: v129.62,65.53 124.59,65.53 120.7,69.42 119.79,69.42 119.1,68.73 119.1,56.62 119.56,56.16 119.56,32.38 v119.33,32.16 | v119.33,28.27 125.04,22.55 125.04,19.58 U$10.2
N$77  (via drill 0.33)
  Top 0.203: v143.79,58.67 138.3,64.16 137.62,64.16 U$9.25 | v138.07,32.61 v143.79,38.33
  Bottom 0.203: v143.79,58.67 143.79,52.27 144.7,51.36 144.7,39.24 v143.79,38.33 | v138.07,32.61 134.65,32.61 134.19,33.07 131.9,33.07 127.1,28.27 127.1,17.53 U$10.3
N$78  (via drill 0.33)
  Top 0.203: v142.42,58.67 138.3,62.79 137.62,62.79 U$9.24 | v133.96,32.16 v143.79,41.99
  Bottom 0.203: v142.42,58.67 142.42,52.96 143.79,51.59 v143.79,41.99 | v133.96,32.16 131.67,32.16 128.93,29.41 128.93,16.38 129.16,16.15 U$10.4
N$79  (via drill 0.33)
  Top 0.203: v129.62,62.56 130.3,61.87 137.39,61.87 U$9.23 | v126.19,34.21 126.19,33.3 125.73,32.84 125.73,31.24 v129.84,27.13
  Bottom 0.203: v129.62,62.56 126.19,59.13 v126.19,34.21 | v129.84,27.13 129.84,17.3 131.9,15.24 U$10.5
N$80  (via drill 0.33)
  Top 0.203: v129.62,61.42 130.53,60.5 137.39,60.5 U$9.22 | v130.76,30.1 v127.1,33.76
  Bottom 0.203: v129.62,61.42 127.1,58.9 v127.1,33.76 | v130.76,30.1 130.76,19.13 134.65,15.24 U$10.6
N$81  (via drill 0.33)
  Top 0.203: v133.27,55.7 136.7,59.13 137.39,59.13 U$9.21 | v133.04,30.1 v133.04,41.07
  Bottom 0.203: v133.27,55.7 133.27,51.59 132.59,50.9 132.59,41.53 v133.04,41.07 | v133.04,30.1 133.04,29.64 137.39,25.3 137.39,16.15 U$10.7
N$82  (via drill 0.33)
  Top 0.203: v149.05,53.42 144.7,57.76 137.62,57.76 U$9.20
  Bottom 0.203: v149.05,53.42 149.05,28.5 148.82,28.27 148.82,25.53 151.79,22.55 151.79,21.64 147.68,17.53 139.9,17.53 U$10.8
N$83  (via drill 0.33)
  Top 0.203: v139.68,51.59 140.36,52.27 140.36,55.47 139.22,56.62 137.62,56.62 U$9.19
  Bottom 0.203: v139.68,51.59 139.68,33.98 141.05,32.61 141.05,31.24 140.36,30.56 140.36,20.73 141.5,19.58 U$10.9
N$84  (via drill 0.33)
  Top 0.203: v139.45,55.24 137.62,55.24 U$9.18
  Bottom 0.203: v139.45,55.24 142.88,51.82 142.88,29.41 141.73,28.27 141.73,23.24 142.65,22.33 U$10.10
N$85
  Top 0.254: U$9.27 U$11.2
N$86  (via drill 0.33)
  Top 0.203: v139.45,54.1 U$9.17
  Bottom 0.203: v139.45,54.1 141.73,51.82 141.73,30.33 U$10.13
N$87  (via drill 0.33)
  Top 0.203: U$9.12 131.9,54.1 v132.36,53.64
  Bottom 0.203: v132.36,53.64 132.36,51.36 132.13,51.13 132.13,40.84 139.68,33.3 139.68,32.38 U$10.14
N$88  (via drill 0.33)
  Top 0.203: v131.9,55.24 128.02,55.24 U$9.11
  Bottom 0.203: v131.9,55.24 131.9,54.33 131.44,53.87 131.44,39.93 137.39,33.98 U$10.15
N$89  (via drill 0.33)
  Top 0.203: v131.22,56.16 130.76,56.62 128.02,56.62 U$9.10
  Bottom 0.203: v131.22,56.16 131.22,55.7 130.99,55.47 130.99,38.33 134.65,34.67 U$10.16
N$90  (via drill 0.33)
  Top 0.203: v129.62,57.76 128.02,57.76 U$9.9
  Bottom 0.203: v129.62,57.76 129.62,52.73 128.93,52.04 128.93,37.64 131.9,34.67 U$10.17
N$91  (via drill 0.33)
  Top 0.203: v129.62,59.13 128.02,59.13 U$9.8
  Bottom 0.203: v129.62,59.13 128.47,57.99 128.47,34.67 129.16,33.98 U$10.18
N$92  (via drill 0.33)
  Top 0.203: v129.62,60.27 128.02,60.27 U$9.7
  Bottom 0.203: v129.62,60.27 128.02,58.67 128.02,33.3 127.1,32.38 U$10.19
N$93  (via drill 0.33)
  Top 0.203: v125.73,60.27 127.1,61.65 127.79,61.65 U$9.6
  Bottom 0.203: v125.73,60.27 125.73,57.3 120.7,52.27 120.7,34.67 125.04,30.33 U$10.20
N$94  (via drill 0.33)
  Top 0.203: v124.82,55.24 124.82,60.5 127.1,62.79 127.79,62.79 U$9.5
  Bottom 0.203: v124.82,55.24 124.82,54.56 121.16,50.9 121.16,35.81 126.19,30.78 126.19,29.64 124.36,27.81 123.9,27.81 U$10.21
N$95  (via drill 0.33)
  Top 0.203: U$11.26 164.59,65.53 v172.14,57.99 | v162.53,30.1 v171.22,38.79 | v157.96,25.3 156.59,25.3 155.91,25.98 153.39,25.98 151.79,24.38 151.79,19.58 U$12.2
  Bottom 0.203: v172.14,57.99 173.05,57.07 173.05,40.61 v171.22,38.79 | v162.53,30.1 162.53,26.44 161.16,25.07 158.19,25.07 v157.96,25.3
N$96  (via drill 0.33)
  Top 0.203: v172.14,56.84 164.82,64.16 164.13,64.16 U$11.25 | v158.65,30.1 v172.14,43.59 | v153.62,25.07 153.62,17.53 U$12.3
  Bottom 0.203: v172.14,43.59 v172.14,56.84 | v153.62,25.07 v158.65,30.1
N$97  (via drill 0.33)
  Top 0.203: v171.22,52.04 171.22,56.39 164.82,62.79 164.13,62.79 U$11.24 | v160.02,34.9 v171.22,46.1 | v156.13,24.61 156.13,16.15 U$12.4
  Bottom 0.203: v171.22,46.1 v171.22,52.04 | v160.02,34.9 160.02,28.5 v156.13,24.61
N$98  (via drill 0.33)
  Top 0.203: v170.31,56.16 164.82,61.65 164.13,61.65 U$11.23 | v170.31,29.64 170.31,28.5 170.99,27.81 v170.99,21.87
  Bottom 0.203: v170.31,29.64 v170.31,56.16 | v170.99,21.87 170.99,20.27 166.88,16.15 165.51,16.15 164.59,17.07 160.48,17.07 158.65,15.24 U$12.5
N$99  (via drill 0.33)
  Top 0.203: v165.74,59.59 165.05,60.27 164.13,60.27 U$11.22
  Bottom 0.203: v165.74,59.59 165.74,62.56 173.28,70.1 174.19,70.1 174.65,69.65 174.65,26.44 178.31,22.78 178.31,21.64 170.99,14.33 162.31,14.33 161.62,15.01 U$12.6
N$100  (via drill 0.33)
  Top 0.203: v168.48,55.47 164.82,59.13 164.13,59.13 U$11.21 | v168.48,33.76 168.48,32.61 172.14,28.96 v172.14,21.87
  Bottom 0.203: v168.48,33.76 v168.48,55.47 | v172.14,21.87 172.14,20.73 167.11,15.7 164.36,15.7 164.13,15.93 U$12.7
N$101  (via drill 0.33)
  Top 0.203: v169.39,53.19 164.82,57.76 164.13,57.76 U$11.20
  Bottom 0.203: v169.39,53.19 169.39,29.19 168.25,28.04 168.25,24.84 169.85,23.24 171.91,23.24 173.05,22.1 173.05,20.95 166.88,14.78 163.45,14.78 161.85,16.38 160.93,16.38 159.79,15.24 159.79,14.78 158.88,13.87 158.19,13.87 157.5,14.55 157.5,15.7 159.33,17.53 166.42,17.53 U$12.8
N$102  (via drill 0.33)
  Top 0.203: v156.13,68.73 156.13,63.7 162.99,56.84 163.91,56.84 U$11.19
  Bottom 0.203: v156.13,68.73 156.13,66.45 149.96,60.27 149.96,28.73 149.28,28.04 149.28,27.36 157.05,19.58 168.25,19.58 U$12.9
N$103  (via drill 0.33)
  Top 0.203: v162.08,55.24 163.91,55.24 U$11.18
  Bottom 0.203: v162.08,55.24 159.11,52.27 159.11,41.3 167.56,32.84 167.56,31.01 167.11,30.56 167.11,24.61 169.39,22.33 U$12.10
N$104  (via drill 0.33)
  Top 0.203: U$11.17 165.28,54.1 v167.34,52.04
  Bottom 0.203: v167.34,52.04 167.34,33.76 168.25,32.84 168.25,30.33 U$12.13
N$105  (via drill 0.33)
  Top 0.203: U$11.12 158.65,54.1 v159.11,54.56
  Bottom 0.203: v159.11,54.56 159.11,52.96 158.65,52.5 158.65,40.84 166.42,33.07 166.42,32.38 U$12.14
N$106  (via drill 0.33)
  Top 0.203: v158.65,55.47 154.76,55.47 U$11.11
  Bottom 0.203: v158.65,55.47 158.19,55.02 158.19,39.7 163.91,33.98 U$12.15
N$107
  Top 0.254: U$7.27 U$9.2
N$108  (via drill 0.33)
  Top 0.203: v157.96,56.62 154.76,56.62 U$11.10
  Bottom 0.203: v157.96,56.62 157.96,55.93 157.73,55.7 157.73,38.33 161.39,34.67 U$12.16
N$109  (via drill 0.33)
  Top 0.203: v238.43,25.53 238.43,27.13 L2.4-DIN | v267.69,20.95 267.69,21.87 268.15,22.33 L1.2-DOUT
  Bottom 0.203: v238.43,25.53 238.89,25.07 244.83,25.07 248.94,20.95 v267.69,20.95
N$110
  Top 0.203: L2.2-DOUT 241.86,22.55 241.86,25.07 242.54,25.76 242.54,28.27 242.09,28.73 233.17,28.73 225.4,20.95 214.66,20.95 214.2,21.41 214.2,24.38 216.03,26.21 216.03,28.04 215.57,28.5 213.06,28.5 211.91,27.36 L3.4-DIN
N$111
  Bottom 0.254: U$8.11 119.63,24.89 122.43,22.1 123.88,22.1 U$10.1
N$112
  Bottom 0.254: U$6.11 92.96,24.89 95.76,22.1 97.21,22.1 U$8.1
N$113
  Bottom 0.254: U$4.11 66.04,24.89 68.83,22.1 70.54,22.1 U$6.1
N$114
  Bottom 0.254: U$2.11 39.5,24.89 42.29,22.1 43.87,22.1 U$4.1
N$115  (via drill 0.33)
  Top 0.203: v152.93,57.07 153.62,57.76 154.53,57.76 U$11.9
  Bottom 0.203: v152.93,57.07 152.93,40.16 158.42,34.67 U$12.17
N$116  (via drill 0.33)
  Top 0.203: v152.93,58.22 153.85,59.13 154.53,59.13 U$11.8
  Bottom 0.203: v152.93,58.22 152.02,57.3 152.02,37.87 155.91,33.98 U$12.18
N$117  (via drill 0.33)
  Top 0.203: v151.79,58.45 153.62,60.27 154.53,60.27 U$11.7
  Bottom 0.203: v151.79,58.45 151.79,57.76 151.56,57.53 151.56,34.21 153.39,32.38 U$12.19
N$118  (via drill 0.33)
  Top 0.203: v151.79,59.59 153.85,61.65 154.53,61.65 U$11.6
  Bottom 0.203: v151.79,59.59 150.88,58.67 150.88,31.01 151.56,30.33 U$12.20
N$119  (via drill 0.33)
  Top 0.203: v150.88,60.05 153.62,62.79 154.53,62.79 U$11.5
  Bottom 0.203: v150.88,60.05 150.88,59.36 150.42,58.9 150.42,27.81 U$12.21
N$120  (via drill 0.33)
  Top 0.203: U$13.26 192.48,65.53 v197.05,60.96 | v197.05,47.93 183.79,34.67 v183.79,25.53
  Bottom 0.203: v197.05,47.93 v197.05,60.96 | v183.79,25.53 183.79,21.87 181.51,19.58 178.54,19.58 U$14.2
N$121  (via drill 0.33)
  Top 0.203: v183.79,70.1 189.51,64.39 191.57,64.39 U$13.25 | v181.28,20.5 181.28,18.44 180.37,17.53 U$14.3
  Bottom 0.203: v183.79,70.1 175.11,61.42 175.11,26.67 v181.28,20.5
N$122  (via drill 0.33)
  Top 0.203: v196.14,59.36 192.71,62.79 191.79,62.79 U$13.24
  Bottom 0.203: v196.14,59.36 196.14,29.19 189.05,22.1 189.05,17.75 186.54,15.24 186.54,14.78 185.62,13.87 184.71,13.87 182.65,15.93 U$14.4
N$123  (via drill 0.33)
  Top 0.203: v183.79,68.96 190.88,61.87 191.57,61.87 U$13.23
  Bottom 0.203: v183.79,68.96 183.79,63.7 175.56,55.47 175.56,27.13 176.71,25.98 183.11,25.98 183.57,26.44 184.02,26.44 184.71,25.76 184.71,24.84 184.25,24.38 184.25,16.15 185.17,15.24 U$14.5
N$124  (via drill 0.33)
  Top 0.203: v194.54,51.36 194.54,58.45 192.71,60.27 191.79,60.27 U$13.22 | v188.14,17.98 188.14,15.24 U$14.6
  Bottom 0.203: v194.54,51.36 194.54,31.47 188.14,25.07 v188.14,17.98
N$125  (via drill 0.33)
  Top 0.203: v193.4,58.22 192.48,59.13 191.79,59.13 U$13.21 | v189.51,33.07 189.51,28.73 190.65,27.58 190.65,16.15 U$14.7
  Bottom 0.203: v193.4,58.22 193.4,54.33 192.71,53.64 192.71,37.19 193.4,36.5 193.4,34.9 191.11,32.61 189.97,32.61 v189.51,33.07
N$126  (via drill 0.33)
  Top 0.203: v189.97,56.84 190.88,57.76 191.57,57.76 U$13.20 | v191.57,38.33 191.57,34.67 192.02,34.21 192.02,18.44 192.94,17.53 U$14.8
  Bottom 0.203: v189.97,56.84 191.57,55.24 v191.57,38.33
N$127  (via drill 0.33)
  Top 0.203: v189.97,55.47 191.11,56.62 191.57,56.62 U$13.19 | v192.48,36.27 197.74,31.01 197.74,22.1 195,19.36 U$14.9
  Bottom 0.203: v189.97,55.47 189.97,52.5 190.65,51.82 190.65,38.1 v192.48,36.27
N$128  (via drill 0.33)
  Top 0.203: v188.82,53.19 190.88,55.24 191.57,55.24 U$13.18 | v192.48,35.13 192.48,34.67 194.31,32.84 194.31,31.24 193.85,30.78 193.85,24.61 196.14,22.33 U$14.10
  Bottom 0.203: v188.82,53.19 188.82,38.79 v192.48,35.13
N$129  (via drill 0.33)
  Top 0.203: U$13.17 192.94,54.1 v193.62,53.42
  Bottom 0.203: v193.62,53.42 195.45,51.59 195.45,30.78 195,30.33 U$14.13
N$130  (via drill 0.33)
  Top 0.203: v180.59,54.1 U$13.12
  Bottom 0.203: v180.59,54.1 180.59,53.42 184.02,49.99 184.02,34.21 186.08,32.16 192.94,32.16 U$14.14
N$131  (via drill 0.33)
  Top 0.203: v186.08,53.19 184.02,55.24 182.42,55.24 U$13.11
  Bottom 0.203: v186.08,53.19 186.08,52.73 188.37,50.44 188.37,36.27 190.65,33.98 U$14.15
N$132  (via drill 0.33)
  Top 0.203: v185.62,54.79 183.79,56.62 182.42,56.62 U$13.10
  Bottom 0.203: v185.62,54.79 185.62,53.87 185.17,53.42 185.17,52.96 187.91,50.22 187.91,34.67 U$14.16
N$133
  Top 0.254: U$5.27 U$7.2
N$134  (via drill 0.33)
  Top 0.203: v185.62,51.36 187,52.73 187,54.56 183.79,57.76 182.42,57.76 U$13.9
  Bottom 0.203: v185.62,51.36 185.62,34.9 185.4,34.67 U$14.17
N$135
  Top 0.203: L3.2-DOUT 215.11,22.55 215.11,24.61 216.48,25.98 216.48,28.27 215.8,28.96 211.91,28.96 201.62,39.24 191.11,39.24 186.54,34.67 186.54,29.64 185.17,28.27 185.17,27.36 L4.4-DIN
N$136  (via drill 0.33)
  Top 0.203: v180.37,57.99 181.51,59.13 182.19,59.13 U$13.8
  Bottom 0.203: v180.37,57.99 180.37,55.02 179.68,54.33 179.68,53.64 182.42,50.9 182.42,33.98 U$14.18
N$137  (via drill 0.33)
  Top 0.203: v180.37,59.13 181.51,60.27 182.19,60.27 U$13.7
  Bottom 0.203: v180.37,59.13 176.02,54.79 176.02,27.36 176.94,26.44 177.62,26.44 180.14,28.96 180.14,32.16 U$14.19
N$138  (via drill 0.33)
  Top 0.203: v179.45,52.73 179.45,59.59 181.51,61.65 182.19,61.65 U$13.6
  Bottom 0.203: v179.45,52.73 179.45,33.07 178.99,32.61 178.99,30.78 178.54,30.33 U$14.20
N$139  (via drill 0.33)
  Top 0.203: v178.54,52.04 178.54,59.82 181.51,62.79 182.19,62.79 U$13.5
  Bottom 0.203: v178.54,52.04 178.54,31.93 177.16,30.56 177.16,27.81 U$14.21
N$140  (via drill 0.33)
  Top 0.203: v213.74,65.53 U$15.26 | v211.68,65.3 211.68,65.76 210.08,67.36 210.08,68.5 v209.4,69.19
  Bottom 0.203: v213.74,65.53 211.91,65.53 v211.68,65.3 | v209.4,69.19 209.4,62.56 203.91,57.07 203.91,29.19 205.05,28.04 205.05,19.58 U$16.2
N$141  (via drill 0.33)
  Top 0.203: v227.69,55.24 218.77,64.16 218.08,64.16 U$15.25 | v206.88,14.78 206.88,17.3 U$16.3
  Bottom 0.203: v227.69,55.24 227.69,31.01 220.83,24.16 220.83,20.27 220.37,19.81 220.37,18.44 221.06,17.75 221.06,17.07 216.94,12.95 208.71,12.95 v206.88,14.78
N$142  (via drill 0.33)
  Top 0.203: v223.8,57.76 218.77,62.79 218.08,62.79 U$15.24 | v221.28,28.04 v223.8,30.56
  Bottom 0.203: v223.8,30.56 v223.8,57.76 | v221.28,28.04 209.4,16.15 U$16.4
N$143  (via drill 0.33)
  Top 0.203: v209.4,70.33 210.54,69.19 210.54,67.59 216.26,61.87 217.86,61.87 U$15.23 | v201.62,36.04 210.77,26.9 210.77,26.44 212.6,24.61 212.6,15.7 212.14,15.24 U$16.5
  Bottom 0.203: v209.4,70.33 201.62,62.56 v201.62,36.04
N$144  (via drill 0.33)
  Top 0.203: v221.97,57.07 218.77,60.27 218.08,60.27 U$15.22 | v221.97,32.16 220.37,30.56 v220.37,25.76
  Bottom 0.203: v221.97,32.16 v221.97,57.07 | v220.37,25.76 220.37,20.73 214.88,15.24 U$16.6
N$145  (via drill 0.33)
  Top 0.203: v228.6,52.5 225.4,52.5 218.77,59.13 218.08,59.13 U$15.21 | v229.51,23.47 229.51,22.78 222.88,16.15 217.63,16.15 U$16.7
  Bottom 0.203: v228.6,52.5 229.51,51.59 229.51,28.27 229.29,28.04 229.29,23.7 v229.51,23.47
N$146  (via drill 0.33)
  Top 0.203: v222.88,53.64 218.77,57.76 218.08,57.76 U$15.20
  Bottom 0.203: v222.88,53.64 222.88,29.87 221.97,28.96 215.57,28.96 213.74,30.78 212.14,30.78 206.2,24.84 206.2,18.44 205.74,17.98 205.74,17.07 209.4,13.41 216.48,13.41 219.69,16.61 219.69,17.3 U$16.8
N$147  (via drill 0.33)
  Top 0.203: v228.6,51.36 224.03,51.36 218.77,56.62 218.08,56.62 U$15.19 | v228.6,23.01 228.14,23.01 224.71,19.58 221.74,19.58 U$16.9
  Bottom 0.203: v228.6,23.01 v228.6,51.36
N$148  (via drill 0.33)
  Top 0.203: v219.69,54.33 218.77,55.24 218.08,55.24 U$15.18 | v219.69,33.76 218.54,32.61 218.54,26.44 222.66,22.33 U$16.10
  Bottom 0.203: v219.69,33.76 v219.69,54.33
N$149  (via drill 0.33)
  Top 0.203: U$15.17 218.77,54.1 v221.06,51.82
  Bottom 0.203: v221.06,51.82 221.06,30.78 221.51,30.33 U$16.13
N$150  (via drill 0.33)
  Top 0.203: v206.88,54.1 U$15.12
  Bottom 0.203: v206.88,54.1 206.88,33.98 205.74,32.84 205.74,31.93 206.43,31.24 218.77,31.24 219.69,32.16 U$16.14
N$151  (via drill 0.33)
  Top 0.203: v212.37,53.19 210.31,55.24 208.71,55.24 U$15.11
  Bottom 0.203: v212.37,53.19 212.37,52.73 215.11,49.99 215.11,36.27 217.4,33.98 U$16.15
N$152  (via drill 0.33)
  Top 0.203: v211.68,55.02 210.08,56.62 208.71,56.62 U$15.10
  Bottom 0.203: v211.68,55.02 211.68,53.64 211.46,53.42 211.46,52.96 214.66,49.76 214.66,34.67 U$16.16
N$153  (via drill 0.33)
  Top 0.203: v211.91,51.36 213.28,52.73 213.28,54.56 210.08,57.76 208.71,57.76 U$15.9
  Bottom 0.203: v211.91,51.36 211.91,34.67 U$16.17
N$154  (via drill 0.33)
  Top 0.203: v206.88,58.22 207.8,59.13 208.48,59.13 U$15.8
  Bottom 0.203: v206.88,58.22 206.88,55.24 209.17,52.96 209.17,33.98 U$16.18
N$155
  Top 0.254: U$3.27 U$5.2
N$156  (via drill 0.33)
  Top 0.203: v216.26,53.42 209.4,60.27 208.71,60.27 U$15.7
  Bottom 0.203: v216.26,53.42 216.26,52.5 218.54,50.22 218.54,33.3 217.63,32.38 207.11,32.38 U$16.19
N$157
  Top 0.203: L5.4-DIN 158.42,27.36 158.88,27.36 160.25,28.73 162.08,28.73 162.53,28.27 162.53,26.44 160.71,24.61 160.71,21.64 161.39,20.95 180.37,20.95 186.08,26.67 186.08,28.5 186.54,28.96 188.59,28.96 189.28,28.27 189.28,23.47 188.37,22.55 L4.2-DOUT
N$158
  Top 0.203: L5.2-DOUT 161.85,22.55 161.85,25.07 162.99,26.21 162.99,28.5 162.31,29.19 152.25,29.19 152.02,28.96 135.79,28.96 135.56,29.19 133.04,29.19 131.9,28.04 131.9,27.36 L6.4-DIN
N$159  (via drill 0.33)
  Top 0.203: v205.05,51.36 205.05,58.9 207.8,61.65 208.48,61.65 U$15.6